# EasyEDA Pro project ProPrj_智能警报器_2025-03-04_22-10-02_2025-04-14.epro, schematic Warning

## Sheets
1 主控: Board Name: 警报装置（旧）; Create Date: 2025-04-03; Page Name: 主控; Project Name: 智能警报器_2025-03-04_22-10-02; Schematic Name: Warning; Update Date: 2025-04-04; Company: 嘉立创EDA; Page Size: A4; Version: V1.0
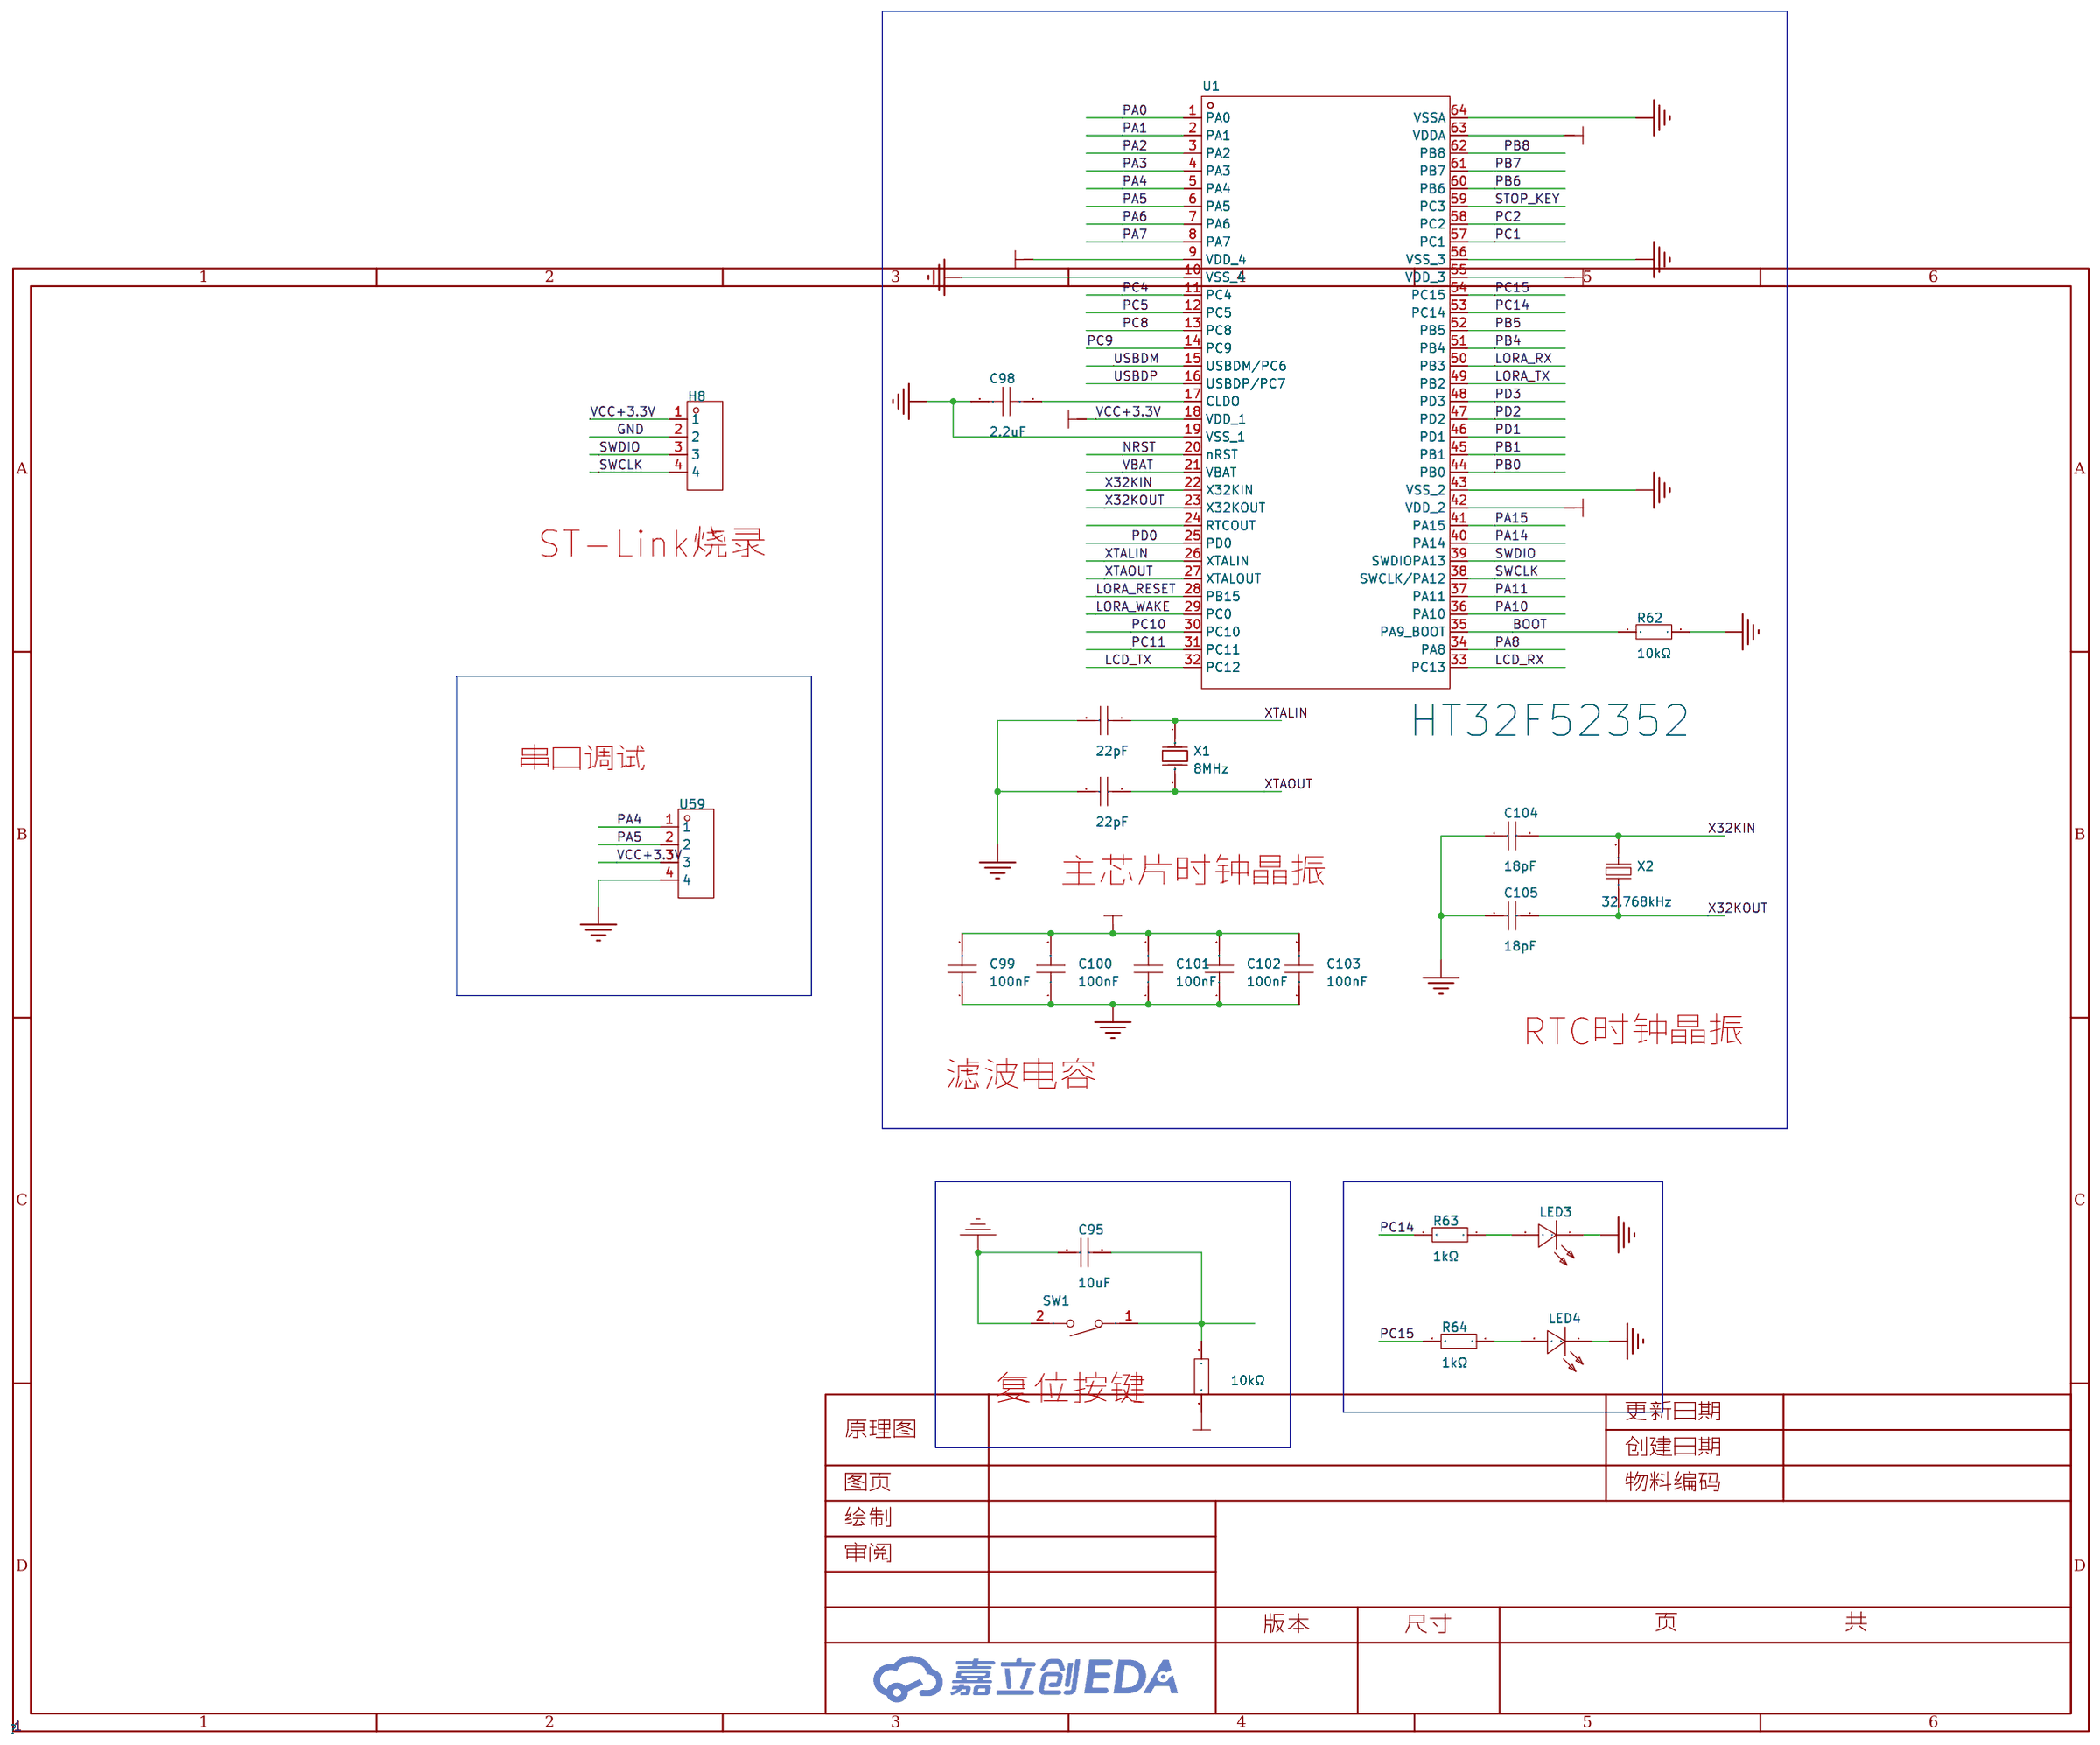
[diagram p0: 主控]
2 模块与接口: Board Name: 警报装置; Page Name: 模块与接口; Update Date: 2025-04-03
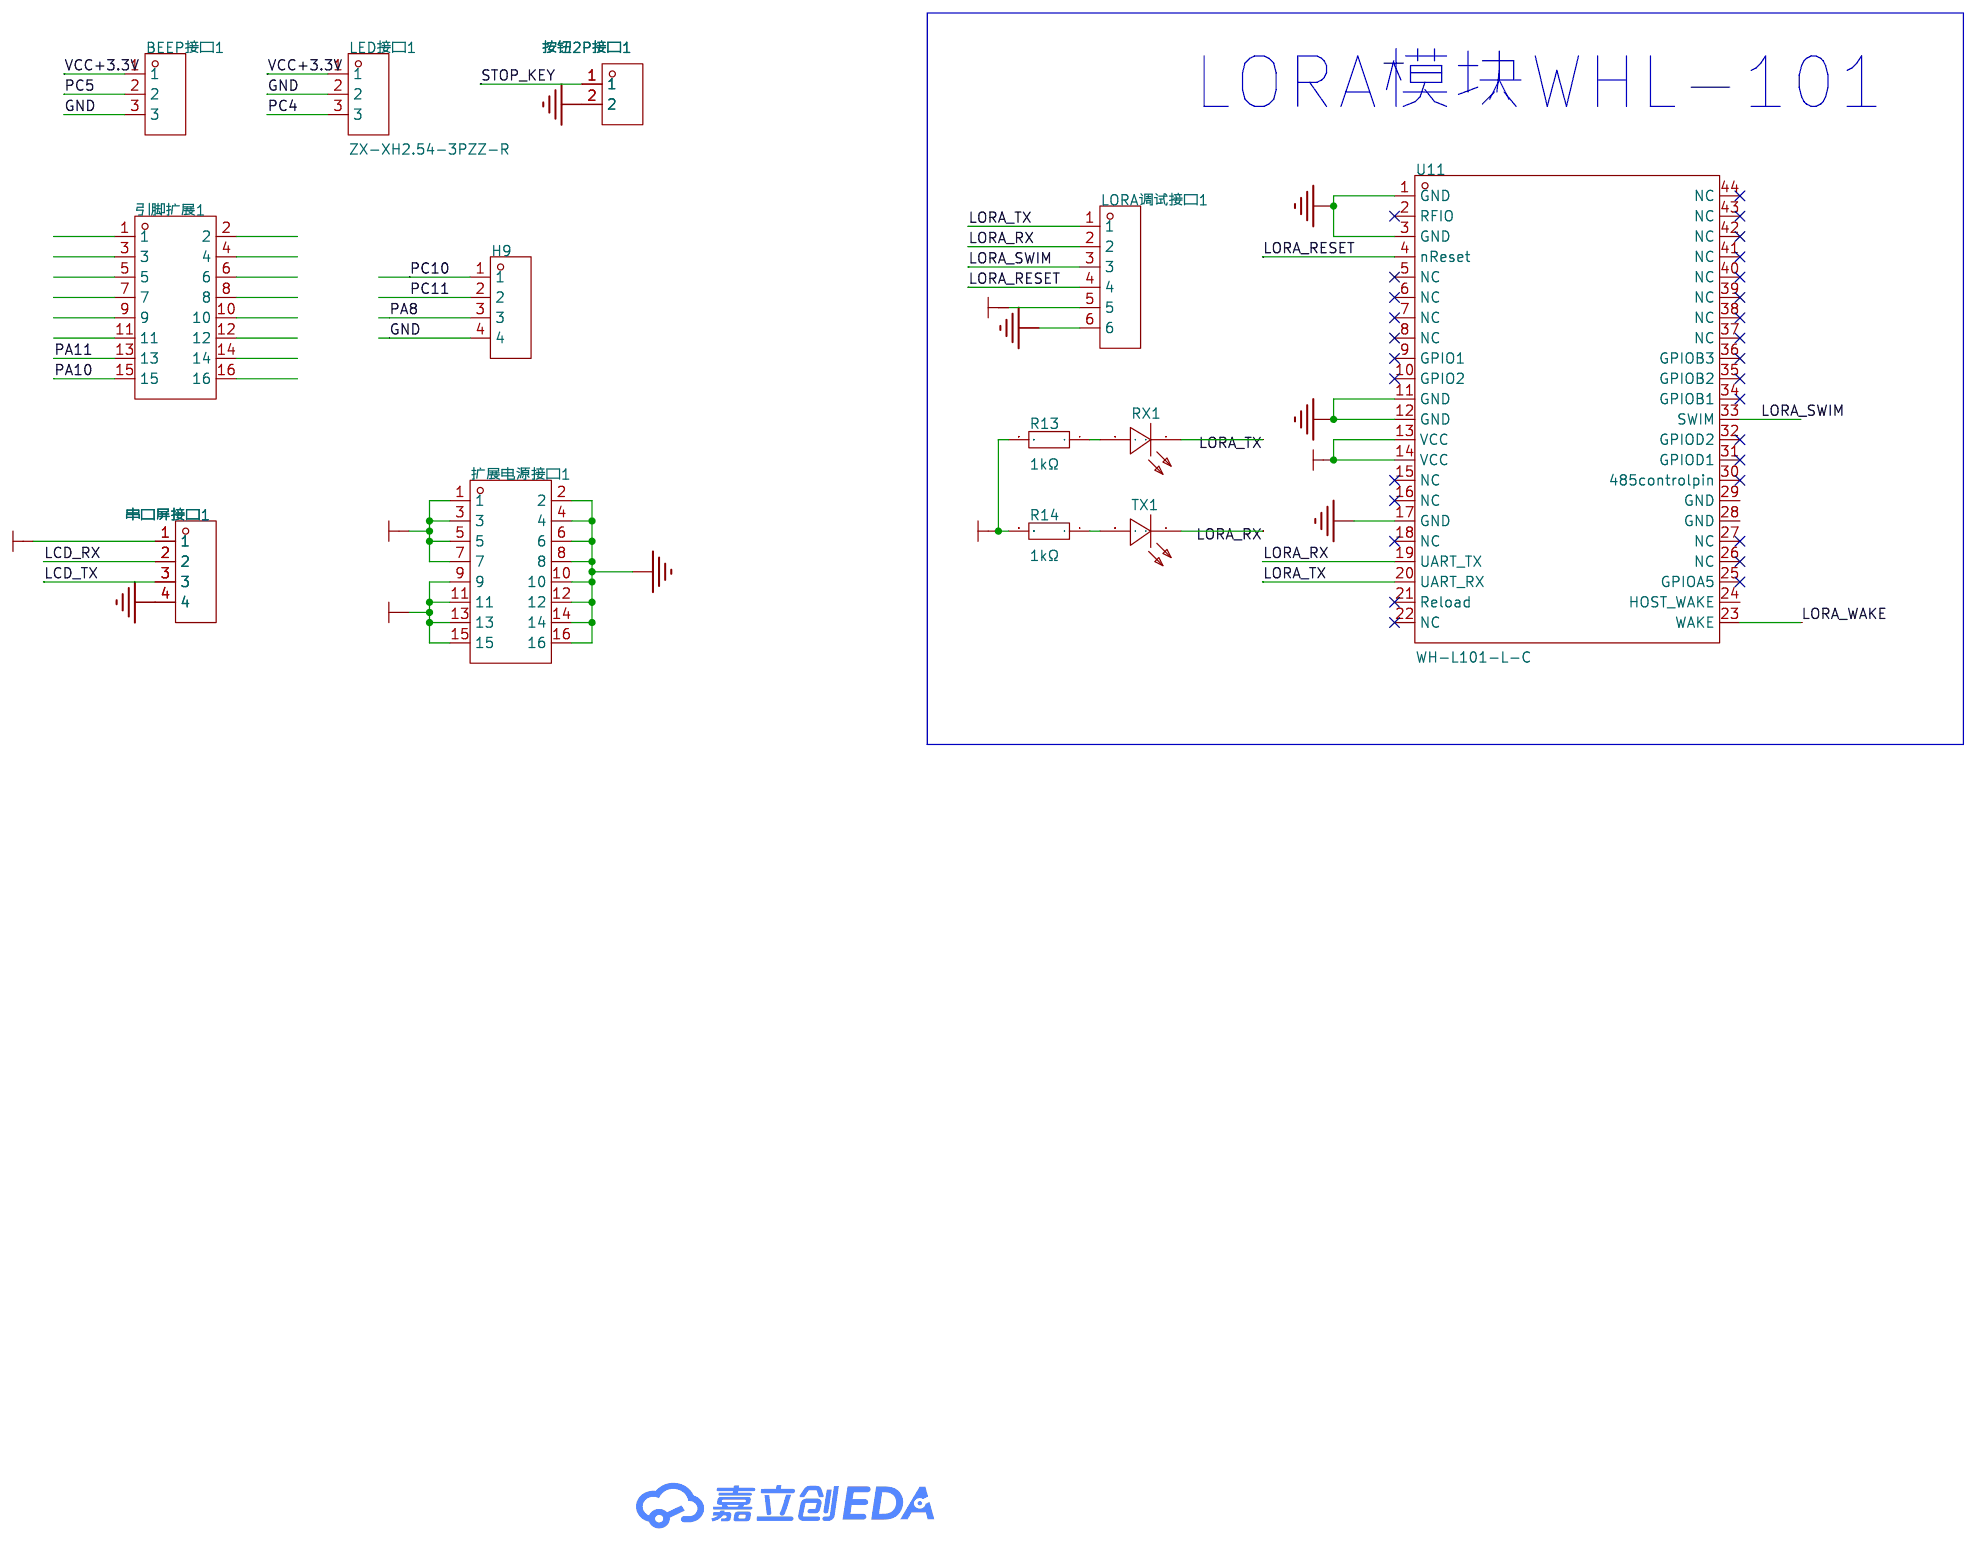
[diagram p1: 模块与接口]
3 电源: Board Name: HT32; Page Name: 电源; Schematic Name: Schematic1_1; Update Date: 2025-04-03
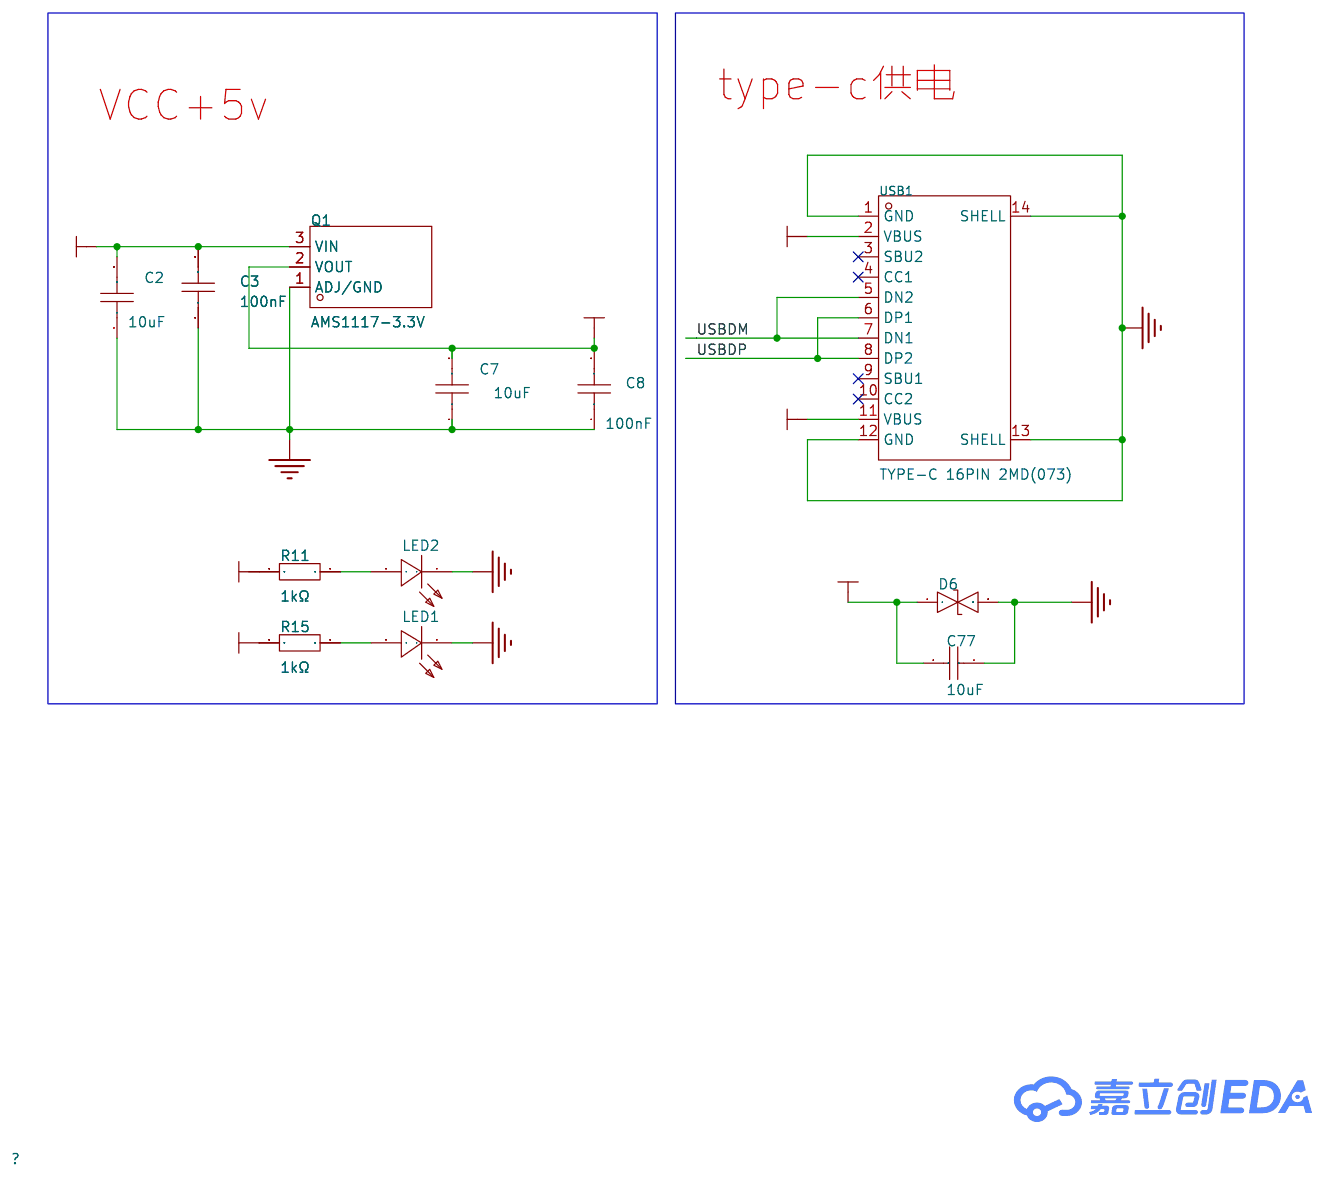
[diagram p2: 电源]

## Parts
sheet 主控
C80  22pF  [C0603]
C81  22pF  [C0603]
C95  10uF  [C0805]
C98  2.2uF  [C0805]
C99  100nF  [C0603]
C100  100nF  [C0603]
C101  100nF  [C0603]
C102  100nF  [C0603]
C103  100nF  [C0603]
C104  18pF  [C0603]
C105  18pF  [C0603]
H8  PZ254V-11-04P  [HDR-TH_4P-P2.54-V-M]
LED3  KT-0603R  [LED0603-RD]
LED4  KT-0603R  [LED0603-RD]
R61  10kΩ  [R0603]
R62  10kΩ  [R0603]
R63  1kΩ  [R0603]
R64  1kΩ  [R0603]
SW1  TS-1088-AR02016  [SW-SMD_L3.9-W3.0-P4.45]
U1  HT32F52352  [LQFP-64_L7.0-W7.0-P0.40-LS9.2-BL]
U59  PM254-1-04-Z-8.5  [HDR-TH_4P-P2.54-V-F]
X1  8MHz  [CRYSTAL-SMD_L5.0-W3.2]
X2  32.768kHz  [FC-135R_L3.2-W1.5]
sheet 模块与接口
BEEP接口1  ZX-XH2.54-3PZZ-R  [CONN-TH_3P-P2.50_ZX-XH2.54-3PZZ-R]
H9  PZ254V-11-04P  [HDR-TH_4P-P2.54-V-M]
LED接口1  ZX-XH2.54-3PZZ-R  [CONN-TH_3P-P2.50_ZX-XH2.54-3PZZ-R]
LORA调试接口1  PZ254-1-06-Z-2.5-G1  [HDR-TH_6P-P2.54-V-M]
R13  1kΩ  [R0603]
R14  1kΩ  [R0603]
RX1  KT-0603R  [LED0603-RD]
TX1  KT-0603R  [LED0603-RD]
U11  WH-L101-L-C  [COMM-SMD_WH-L101-L-C]
串口屏接口1  ZX-XH2.54-4PZZ  [CONN-TH_4P-P2.50_4PIN]
引脚扩展1  PZ254V-12-16P  [HDR-TH_16P-P2.54-V-M-R2-C8-S2.54]
扩展电源接口1  PZ254V-12-16P  [HDR-TH_16P-P2.54-V-M-R2-C8-S2.54]
按钮2P接口1  ZX-XH2.54-2PZZ  [CONN-TH_2P-P2.50_HX25003-2A]
sheet 电源
C2  10uF  [C0603]
C3  100nF  [C0603]
C7  10uF  [C0603]
C8  100nF  [C0603]
C77  10uF  [C0805]
D6  SMBJ6.8CA  [SMB_L4.6-W3.6-LS5.3-BI]
LED1  KT-0603R  [LED0603-RD]
LED2  KT-0603R  [LED0603-RD]
Q1  AMS1117-3.3V  [SOT-89-3_L4.5-W2.5-P1.50-LS4.2-BR]
R11  1kΩ  [R0603]
R15  1kΩ  [R0603]
USB1  TYPE-C 16PIN 2MD(073)  [USB-C-SMD_TYPE-C-6PIN-2MD-073]

## Library data of the parts
C80 C81 = CC0603JRNPO9BN220: 容值:22pF;精度:±5%;额定电压:50V;材质(温度系数):NP0;; LCSC Part Name: 22pF ±5% 50V; Supplier Part: C105620; Manufacturer: YAGEO(国巨); Supplier Footprint: 0603; JLCPCB Part Class: 扩展库; Datasheet: https://atta.szlcsc.com/upload/public/pdf/source/20170505/1493957838062.pdf; Supplier: LCSC; Tolerance: ±5%; Voltage Rated: 50V; Temperature Coefficient: NP0
C77 C95 = CL21A106KAYNNNE_C15850: VCC+5v; LCSC Part Name: VCC+5v; Supplier Part: C15850; Manufacturer: SAMSUNG(三星); Manufacturer Part: CL21A106KAYNNNE; Supplier Footprint: 0805; JLCPCB Part Class: 基础库; Datasheet: https://atta.szlcsc.com/upload/public/pdf/source/20160103/1457707679302.pdf; Supplier: LCSC; Tolerance: ±10%; Voltage Rated: VCC+5v; Temperature Coefficient: X5R
C98 = CL21A225KBQNNNE: 容值:2.2uF;精度:±10%;额定电压:50V;材质(温度系数):X5R;; LCSC Part Name: 2.2uF ±10% 50V; Supplier Part: C377773; Manufacturer: SAMSUNG(三星); Supplier Footprint: 0805; JLCPCB Part Class: 基础库; Datasheet: https://atta.szlcsc.com/upload/public/pdf/source/20160218/1457707763339.pdf; Supplier: LCSC; Tolerance: ±10%; Voltage Rated: 50V; Temperature Coefficient: X5R
C99-C103 = CC0603KRX7R9BB104: 容值:100nF;精度:±10%;额定电压:50V;材质(温度系数):X7R;; LCSC Part Name: 100nF ±10% 50V; Supplier Part: C14663; Manufacturer: YAGEO(国巨); Supplier Footprint: 0603; JLCPCB Part Class: 基础库; Datasheet: https://atta.szlcsc.com/upload/public/pdf/source/20180910/C282072_33301C7F631E79921B82A8DAC6BCC5B3.pdf; Supplier: LCSC; Tolerance: ±10%; Voltage Rated: 50V; Temperature Coefficient: X7R
C104 C105 = CL10C180JB8NNNC: 容值:18pF;精度:±5%;额定电压:50V;材质(温度系数):C0G;; LCSC Part Name: 18pF ±5% 50V; Supplier Part: C1647; Manufacturer: SAMSUNG(三星); Supplier Footprint: 0603; JLCPCB Part Class: 基础库; Datasheet: https://atta.szlcsc.com/upload/public/pdf/source/20160218/1457707763339.pdf; Supplier: LCSC; Tolerance: ±5%; Voltage Rated: 50V; Temperature Coefficient: C0G
H8 H9 = PZ254V-11-04P: 插针结构:1x4P;间距:2.54mm;行距:-;圆针/方针:方针;安装类型:直插;排数:单排;总PIN位数:4P;额定电流:3A;额定电压:250V;配合针长度:6mm;塑高:2.5mm;端接针长度:3mm;触头材质:-;工作温度范围:-40℃~+105℃;颜色:黑色;; LCSC Part Name: 间距:2.54mm 1x4P 直插 方针; Supplier Part: C2691448; Manufacturer: XFCN(兴飞); Supplier Footprint: 插件,P=2.54mm; JLCPCB Part Class: 扩展库; Datasheet: https://atta.szlcsc.com/upload/public/pdf/source/20200309/C492403_F9F19131791D08044AD4F84F8E751A34.pdf; Supplier: LCSC; Pin Structure: 1x4P; Pitch: 2.54mm; Circluar Pins/Square Pins: 方针; Mounting Type: 直插; Number of Rows: 单排; Number of Pins: 4P; Current Rating (Max): 3A; Voltage Rating (Max): 250V; Length of Mating Pin: 6mm; Insulation Height: 2.5mm; Length of End Connection Pin: 3mm; Operating Temperature Range: -40℃~+105℃; Color: 黑色
LED1-LED4 RX1 TX1 = KT-0603R: 发光颜色:红色;功率:-;正向电流:-;主波长:-;二极管配置:-;透镜颜色:-;色温:-;发光角度:-;载带方式:-;工作温度:-40℃~+85℃;; LCSC Part Name: 0603 红灯 高亮; Supplier Part: C2286; Manufacturer: KENTO; Supplier Footprint: 0603; JLCPCB Part Class: 基础库; Datasheet: https://atta.szlcsc.com/upload/public/pdf/source/20160616/1466072038404.pdf; Supplier: LCSC; Emitted Color: 红色; Operating Temperature: -40℃~+85℃
R61 R62 = 0603WAF1002T5E: 电阻类型:厚膜电阻;阻值:10kΩ;精度:±1%;功率:100mW;; LCSC Part Name: 厚膜电阻 10kΩ ±1% 100mW; Supplier Part: C25804; Manufacturer: UNI-ROYAL(厚声); Supplier Footprint: 0603; JLCPCB Part Class: 基础库; Datasheet: https://atta.szlcsc.com/upload/public/pdf/source/20200306/C422600_1E6D84923E4A46A82E41ADD87F860B5C.pdf; Supplier: LCSC; Type: 厚膜电阻; Tolerance: ±1%; Power(Watts): 100mW; Temperature Coefficient: ±100ppm/℃; Overload Voltage (Max): VCC+5v; Operating Temperature Range: -55℃~+155℃
R11 R13-R15 R63 R64 = RC0603FR-071KL: VCC+5v; LCSC Part Name: 厚膜电阻 1kΩ ±1% 100mW; Supplier Part: C22548; Manufacturer: YAGEO(国巨); Supplier Footprint: 0603; JLCPCB Part Class: Extended Part; Datasheet: https://atta.szlcsc.com/upload/public/pdf/source/20180316/70C0E2BDAE7FCC62C531A5A58D202EE1.pdf; Supplier: LCSC; Type: 厚膜电阻; Tolerance: ±1%; Power(Watts): 100mW; Temperature Coefficient: ±100ppm/℃; Overload Voltage (Max): VCC+5v; Operating Temperature Range: -55℃~+155℃
SW1 = TS-1088-AR02016: 触点电流:50mA;额定电压(DC):12V;绝缘电阻:100MΩ;电路结构:单刀单掷;安装方式:立贴;作用力:160gf@±50gf;机械寿命:10万次;带支架:否;; LCSC Part Name: 4*3*2mm 立贴 轻触开关; Supplier Part: C720477; Manufacturer: XUNPU(讯普); Supplier Footprint: SMD; JLCPCB Part Class: 扩展库; Datasheet: https://atta.szlcsc.com/upload/public/pdf/source/20200810/C720475_60D09DD6C54279ADDB2DC25100F1CC11.pdf; Supplier: LCSC; Contact Current: 50mA; Voltage Rating (DC): 12V; Insulation Resistance: 100MΩ; Circuit: 单刀单掷; Mounting Style: 立贴; Actuator Style: 圆形按钮; Actuator/Cap Color: 黑色; Operating Force: 160gf@±50gf; Mechanical Life: 10万次; Operating Temperature: -30℃~+80℃; Pin Style: SMD接片; Switch Length: 4mm; Switch Width: 3mm; Switch Height: 2mm; Strike Gundam: 否
U1 = HT32F52352: CPU内核:CM0;程序存储容量:128KB;RAM总容量:16KB;GPIO端口数量:51;工作电压范围:2V~3.6V;CPU最大主频:48MHz;程序存储器类型:FLASH;; Supplier Part: C97188; Manufacturer: HOLTEK(合泰/盛群); Supplier Footprint: LQFP-64(7x7); JLCPCB Part Class: 扩展库; Datasheet: https://atta.szlcsc.com/upload/public/pdf/source/20231226/5DA994CBD2B5E793EB1549DB6E6CD66A.pdf; Supplier: LCSC; CPU Core: CM0; Program Storage Size: 128KB; RAM Size: 16KB; GPIO Ports Number: 51; Operating Voltage Range: 2V~3.6V; CPU Maximum Speed: 48MHz; Program Memory Type: FLASH; Operating Temperature Range: -40℃~+85℃; ADC (Bit): 12bit; 16Bit Timer: 5; 32Bit Timer: 2; UART/USART: 4; I2C: 2; I2S: 1; SPI: 2; Universal Serial Bus: 有; Internal Comparator: 有; Peripheral/Function: 低电压检测；看门狗；CCP捕获/比较；乘法器；IrDA；CRC校验；DMA；RTC实时时钟; Watchdog: 有; Real-Time Clock: 有; Infrared Data Association: 有; Low-Voltage Detect: 有; CCP Capture/Compare: 有; Direct Memory Access: 有; Internal Oscillator: 有
U59 = PM254-1-04-Z-8.5_C2897367: 插孔结构:1x4P;间距:2.54mm;行距:-;圆孔/方孔:方孔;安装类型:直插;排数:单排;总孔位数:4P;额定电流:3A;额定电压:-;插孔方向:顶部;塑高:8.5mm;触头材质:铜合金;工作温度范围:-40℃~+105℃;焊接温度(最大值):260℃@5S;; LCSC Part Name: 1x4P 间距:2.54mm 直插; Supplier Part: C2897367; Manufacturer: HCTL(华灿天禄); Supplier Footprint: 插件,P=2.54mm; JLCPCB Part Class: 扩展库; Datasheet: https://atta.szlcsc.com/upload/public/pdf/source/20230609/534BE42964C679BDE98E061007C4ABD6.pdf; Supplier: LCSC; Holes Structure: 1x4P; Pitch: 2.54mm; Circular Hole / Square Hole: 方孔; Mounting Type: 直插; Number of Rows: 单排; Number of Holes: 4P; Current Rating (Max): 3A; Holes Direction: 顶部; Insulation Height: 8.5mm; Contact Material: 铜合金; Operating Temperature Range: -40℃~+105℃; Soldering Temperature(Max): 260℃@5S
X1 = X50328MSB2GI: 晶振类型:贴片晶振;频率:8MHz;常温频差:±10ppm;外接负载电容:20pF;频率稳定度(全温):±50ppm;; LCSC Part Name: 8MHz ±10ppm 20pF YSX530GA; Supplier Part: C115962; Manufacturer: YXC(扬兴晶振); Supplier Footprint: SMD5032; JLCPCB Part Class: 基础库; Datasheet: https://atta.szlcsc.com/upload/public/pdf/source/20230220/0EBFFB9D6D8CE6A211407822BBB6C516.pdf; Supplier: LCSC; Crystal Type: 贴片晶振; Normal temperature Frequency Tolerance: ±10ppm; External load capacitor: 20pF; Frequency Stability(Full temperature range): ±50ppm; Operating Temperature: -40℃~+85℃
X2 = Q13FC1350000400: 频率:32.768kHz;频率公差:±20ppm;负载电容:12.5pF;; LCSC Part Name: 32.768kHz ±20ppm 12.5pF; Supplier Part: C32346; Manufacturer: EPSON(爱普生); Supplier Footprint: SMD3215-2P; JLCPCB Part Class: 基础库; Datasheet: https://atta.szlcsc.com/upload/public/pdf/source/20190108/C32346_746D6B07EAF90824457A96480007685F.pdf; Supplier: LCSC; Crystal Type: 贴片无源晶振; Frequency Tolerance: ±20ppm; Load Capacitance: 12.5pF; Equivalent Series Resistance (ESR): 70kΩ; Operating Temperature: -40℃~+85℃
BEEP接口1 LED接口1 = ZX-XH2.54-3PZZ-R: 插针结构:1x3P;间距:2.5mm;安装方式:直插;参考系列:XH;总PIN数:3P;排数:1;每排PIN数:3;行距:-;额定电流:3A;触头材质:铜合金;触头镀层:锡;工作温度范围:-25℃~+85℃;; LCSC Part Name: 1x3P 间距:2.5mm 直插 系列:XH; Supplier Part: C22388625; Manufacturer: Megastar(兆星); Supplier Footprint: 插件,P=2.5mm; JLCPCB Part Class: 扩展库; Datasheet: https://atta.szlcsc.com/upload/public/pdf/source/20240429/AA686AF86527F4AA0E405D3AA558B9D4.pdf; Supplier: LCSC; Pins Structure: 1x3P; Pitch: 2.5mm; Mounting Type: 直插; Reference Series: XH; Number of Pins: 3P; Number of Rows: 1; Number of PINs Per Row: 3; Rated Current: 3A; Contact Material: 铜合金; Contact Plating: 锡; Operating Temperature: -25℃~+85℃; Rated Voltage (Max): 250V; Plastic Material: PA66; Flame Retardant Rating: UL94V-0; Color: 红色; Z-Height of the Board: 7mm; X-Length of Bottom Edge on Board (Spacing Line): 10mm; Y-Width of Bottom Edge on Board: 5.75mm
LORA调试接口1 = PZ254-1-06-Z-2.5-G1: 插针结构:1x6P;间距:2.54mm;行距:-;圆针/方针:方针;安装类型:直插;排数:单排;总PIN位数:6P;额定电流:3A;配合针长度:6mm;塑高:2.5mm;端接针长度:3mm;触头材质:黄铜;工作温度范围:-40℃~+105℃;焊接温度(最大值):260℃@10S;颜色:黑色;; LCSC Part Name: 1x6P 间距:2.54mm 方针 直插; Supplier Part: C18197913; Manufacturer: HCTL(华灿天禄); Supplier Footprint: 插件,P=2.54mm; Datasheet: https://atta.szlcsc.com/upload/public/pdf/source/20230921/1753130D8F97492C8335A75164C0C73A.pdf; Supplier: LCSC; Pin Structure: 1x6P; Pitch: 2.54mm; Circluar Pins/Square Pins: 方针; Mounting Type: 直插; Number of Rows: 单排; Number of Pins: 6P; Current Rating (Max): 3A; Length of Mating Pin: 6mm; Insulation Height: 2.5mm; Length of End Connection Pin: 3mm; Contact Material: 黄铜; Operating Temperature Range: -40℃~+105℃; Soldering Temperature(Max): 260℃@10S; Color: 黑色
U11 = WH-L101-L-C: Supplier Part: C2839188; Manufacturer: USR(有人物联网); Supplier Footprint: SMD,18.2x26.7mm; JLCPCB Part Class: 扩展库; Datasheet: https://atta.szlcsc.com/upload/public/pdf/source/20210707/C2839188_8B9CF052393124210560C9EDFDE3EF54.pdf; Supplier: LCSC
串口屏接口1 = ZX-XH2.54-4PZZ: 插针结构:1x4P;间距:2.54mm;安装方式:直插;参考系列:XH;总PIN数:4P;排数:1;每排PIN数:4;行距:-;额定电流:3A;触头材质:黄铜;触头镀层:锡;工作温度范围:-25℃~+85℃;; Supplier Part: C7429634; Manufacturer: Megastar(兆星); Supplier Footprint: 插件,P=2.54mm; Datasheet: https://atta.szlcsc.com/upload/public/pdf/source/20230619/B529A2163E0159A644AB3383D208FB03.pdf; Supplier: LCSC; Pins Structure: 1x4P; Pitch: 2.54mm; Mounting Style: 直插; Reference Series: XH; Number of Pins: 4P; Number of Rows: 1; Number of PINs Per Row: 4; Current Rating (Max): 3A; Contact Material: 黄铜; Contact Plating: 锡; Operating Temperature Range: -25℃~+85℃
引脚扩展1 扩展电源接口1 = PZ254V-12-16P: 插针结构:2x8P;间距:2.54mm;行距:2.54mm;圆针/方针:方针;安装类型:直插;排数:双排;总PIN位数:16P;额定电流:-;额定电压:-;配合针长度:6mm;塑高:2.5mm;端接针长度:3mm;触头材质:黄铜;触头镀层:-;工作温度范围:-40℃~+105℃;颜色:黑色;; LCSC Part Name: 间距:2.54mm 2x8P 直插 方针; Supplier Part: C492425; Manufacturer: XFCN(兴飞); Supplier Footprint: 插件,P=2.54mm; JLCPCB Part Class: 扩展库; Datasheet: https://atta.szlcsc.com/upload/public/pdf/source/20200309/C492425_0A00EE06259AD0A0AB9C88167BB69964.pdf; Supplier: LCSC; Pin Structure: 2x8P; Pitch: 2.54mm; Row Spacing: 2.54mm; Circluar Pins/Square Pins: 方针; Mounting Type: 直插; Number of Rows: 双排; Number of Pins: 16P; Length of Mating Pin: 6mm; Insulation Height: 2.5mm; Length of End Connection Pin: 3mm; Contact Material: 黄铜; Operating Temperature Range: -40℃~+105℃; Color: 黑色
按钮2P接口1 = ZX-XH2.54-2PZZ: 插针结构:1x2P;间距:2.54mm;安装方式:直插;参考系列:XH;总PIN数:2P;排数:1;每排PIN数:2;行距:-;额定电流:3A;触头材质:黄铜;触头镀层:锡;工作温度范围:-25℃~+85℃;; Supplier Part: C7429632; Manufacturer: Megastar(兆星); Supplier Footprint: 插件,P=2.54mm; Datasheet: https://atta.szlcsc.com/upload/public/pdf/source/20230619/19BA6947230AA44A04D3EDD65E618FD0.pdf; Supplier: LCSC; Pins Structure: 1x2P; Pitch: 2.54mm; Mounting Style: 直插; Reference Series: XH; Number of Pins: 2P; Number of Rows: 1; Number of PINs Per Row: 2; Current Rating (Max): 3A; Contact Material: 黄铜; Contact Plating: 锡; Operating Temperature Range: -25℃~+85℃
C2 C7 = GRM188R61E106KA73D: VCC+5v; LCSC Part Name: VCC+5v; Supplier Part: C344022; Manufacturer: muRata(村田); Supplier Footprint: 0603; JLCPCB Part Class: Extended Part; Datasheet: https://atta.szlcsc.com/upload/public/pdf/source/20181211/C344022_BB98D43E7DA95E5A749FBFE073C8A3E0.pdf; Supplier: LCSC; Tolerance: ±10%; Voltage Rated: VCC+5v; Temperature Coefficient: X5R
C3 C8 = CC0603KRX7R9BB104: 容值:100nF;精度:±10%;额定电压:50V;材质(温度系数):X7R;; LCSC Part Name: 100nF ±10% 50V; Supplier Part: C14663; Manufacturer: YAGEO(国巨); Supplier Footprint: 0603; JLCPCB Part Class: Basic Part; Datasheet: https://atta.szlcsc.com/upload/public/pdf/source/20180910/C282072_33301C7F631E79921B82A8DAC6BCC5B3.pdf; Supplier: LCSC; Tolerance: ±10%; Voltage Rated: 50V; Temperature Coefficient: X7R
D6 = SMBJ6.8CA_C383713: VCC+5v; Supplier Part: C383713; Manufacturer: BORN(伯恩半导体); Supplier Footprint: SMB(DO-214AA); JLCPCB Part Class: 扩展库; Datasheet: https://atta.szlcsc.com/upload/public/pdf/source/20190828/C383713_0FA059764A36A2B4EE02FD311BBD1A5C.pdf; Supplier: LCSC; Reverse Stand-Off Voltage (Vrwm): 5.8V; Maximum Clamping Voltage: VCC+5v; Peak Pulse Current (Ipp)@10/1000us: 58.1A; Breakdown Voltage: VCC+5v; Reverse Leakage Current (Ir): 500uA
Q1 = AMS1117-3.3V_C5120796: 输出类型:固定;输出极性:正;最大输入电压:18V;输出电压:3.3V;输出电流:1A;; Supplier Part: C5120796; Manufacturer: MSKSEMI(美森科); Supplier Footprint: SOT-89; JLCPCB Part Class: 扩展库; Datasheet: https://atta.szlcsc.com/upload/public/pdf/source/20220727/5E62EAC46FFFF83337622C0FBE1B6BF8.pdf; Supplier: LCSC; Output Type: 固定; Output Polarity: 正; Number of Outputs: 1; Maximum Input Voltage: 18V; Output Voltage: 3.3V; Dropout Voltage: 1.4V@(1A); Quiescent Current (Ground Current): 12mA; Output Current: 1A; Operating Temperature: 0℃~+125℃
USB1 = TYPE-C 16PIN 2MD(073): 连接器类型:Type-C;标准:-;公母:母;端口数量:1;触点数量:16P;安装方式:卧贴;额定电流 - 电源:5A;工作温度范围:-25℃~+85℃;; LCSC Part Name: Type-C 母 卧贴; Supplier Part: C2765186; Manufacturer: SHOU HAN(首韩); Supplier Footprint: SMD; Datasheet: https://atta.szlcsc.com/upload/public/pdf/source/20211123/39B17C16241EAC15C5E277BDA434118E.pdf; Supplier: LCSC; Connector Type: Type-C; Gender: 母; Number of Ports: 1; Number of Contacts: 16P; Mounting Style: 卧贴; Current Rating - Power (Max): 5A; Operating Temperature Range: -25℃~+85℃

## Nets
GND: BEEP接口1.3 C2.1 C3.1 C7.1 C8.1 C77.1 C80.2 C81.2 C95.1 C98.2 C99.1 C100.1 C101.1 C102.1 C103.1 C104.1 C105.1 D6.2 H8.2 H9.4 LED1.1(K) LED2.1(K) LED3.1(K) LED4.1(K) LED接口1.2 LORA调试接口1.6 Q1.1(ADJ/GND) R62.1 SW1.2 U1.10(VSS_4) U1.19(VSS_1) U1.43(VSS_2) U1.56(VSS_3) U1.64(VSSA) U11.1(GND) U11.3(GND) U11.11(GND) U11.12(GND) U11.17(GND) U59.4 USB1.1(GND) USB1.12(GND) USB1.13(SHELL) USB1.14(SHELL) 串口屏接口1.4 扩展电源接口1.2 扩展电源接口1.4 扩展电源接口1.6 扩展电源接口1.8 扩展电源接口1.10 扩展电源接口1.12 扩展电源接口1.14 扩展电源接口1.16 按钮2P接口1.2
VBAT: U1.21(VBAT)
VCC+3.3V: BEEP接口1.1 C7.2 C8.2 C99.2 C100.2 C101.2 C102.2 C103.2 H8.1 LED接口1.1 LORA调试接口1.5 Q1.2(VOUT) R13.2 R14.2 R15.2 R61.2 U1.9(VDD_4) U1.18(VDD_1) U1.42(VDD_2) U1.55(VDD_3) U1.63(VDDA) U11.13(VCC) U11.14(VCC) U59.3 扩展电源接口1.1 扩展电源接口1.3 扩展电源接口1.5 扩展电源接口1.7
VCC+5V: C2.2 C3.2 C77.2 D6.1 Q1.3(VIN) R11.2 USB1.2(VBUS) USB1.11(VBUS) 串口屏接口1.1 扩展电源接口1.9 扩展电源接口1.11 扩展电源接口1.13 扩展电源接口1.15
BOOT: R62.2 U1.35(PA9_BOOT)
LCD_RX: U1.33(PC13) 串口屏接口1.2
LCD_TX: U1.32(PC12) 串口屏接口1.3
LORA_RESET: LORA调试接口1.4 U1.28(PB15) U11.4(nReset)
LORA_RX: LORA调试接口1.2 TX1.1(K) U1.50(PB3) U11.19(UART_TX)
LORA_SWIM: LORA调试接口1.3 U11.33(SWIM)
LORA_TX: LORA调试接口1.1 RX1.1(K) U1.49(PB2) U11.20(UART_RX)
LORA_WAKE: U1.29(PC0) U11.23(WAKE)
NRST: U1.20(nRST)
PA0: U1.1(PA0)
PA1: U1.2(PA1)
PA2: U1.3(PA2)
PA3: U1.4(PA3)
PA4: U1.5(PA4) U59.1
PA5: U1.6(PA5) U59.2
PA6: U1.7(PA6)
PA7: U1.8(PA7)
PA8: H9.3 U1.34(PA8)
PA10: U1.36(PA10) 引脚扩展1.15
PA11: U1.37(PA11) 引脚扩展1.13
PA14: U1.40(PA14)
PA15: U1.41(PA15)
PB0: U1.44(PB0)
PB1: U1.45(PB1)
PB4: U1.51(PB4)
PB5: U1.52(PB5)
PB6: U1.60(PB6)
PB7: U1.61(PB7)
PB8: U1.62(PB8)
PC1: U1.57(PC1)
PC2: U1.58(PC2)
PC4: LED接口1.3 U1.11(PC4)
PC5: BEEP接口1.2 U1.12(PC5)
PC8: U1.13(PC8)
PC9: U1.14(PC9)
PC10: H9.1 U1.30(PC10)
PC11: H9.2 U1.31(PC11)
PC14: R63.2 U1.53(PC14)
PC15: R64.2 U1.54(PC15)
PD0: U1.25(PD0)
PD1: U1.46(PD1)
PD2: U1.47(PD2)
PD3: U1.48(PD3)
STOP_KEY: U1.59(PC3) 按钮2P接口1.1
SWCLK: H8.4 U1.38(SWCLK/PA12)
SWDIO: H8.3 U1.39(SWDIOPA13)
USBDM: U1.15(USBDM/PC6) USB1.5(DN2) USB1.7(DN1)
USBDP: U1.16(USBDP/PC7) USB1.6(DP1) USB1.8(DP2)
X32KIN: C104.2 U1.22(X32KIN) X2.2
X32KOUT: C105.2 U1.23(X32KOUT) X2.1
XTALIN: C81.1 U1.26(XTALIN) X1.1(OSC1)
XTAOUT: C80.1 U1.27(XTALOUT) X1.2(OSC2)
$1N1719: C98.1 U1.17(CLDO)
$1N3071: C95.2 R61.1 SW1.1
$1N5057: LED3.2(A) R63.1
$1N5060: LED4.2(A) R64.1
$2N1998: R14.1 TX1.2(A)
$2N1999: R13.1 RX1.2(A)
$3N700: LED2.2(A) R11.1
$3N701: LED1.2(A) R15.1

Not connected (* = marked no-connect by the designer): U1 24(RTCOUT); U11 2(RFIO)* 5(NC)* 6(NC)* 7(NC)* 8(NC)* 9(GPIO1)* 10(GPIO2)* 15(NC)* 16(NC)* 18(NC)* 21(Reload)* 22(NC)* 24(HOST_WAKE) 25(GPIOA5)* 26(NC)* 27(NC)* 28(GND) 29(GND) 30(485controlpin)* 31(GPIOD1)* 32(GPIOD2)* 34(GPIOB1)* 35(GPIOB2)* 36(GPIOB3)* 37(NC)* 38(NC)* 39(NC)* 40(NC)* 41(NC)* 42(NC)* 43(NC)* 44(NC)*; USB1 3(SBU2)* 4(CC1)* 9(SBU1)* 10(CC2)*; 引脚扩展1 1 2 3 4 5 6 7 8 9 10 11 12 14 16

## Notes on the sheets
sheet 1
- ST-Link烧录
- 串口调试
- 主芯片时钟晶振
- RTC时钟晶振
- 滤波电容
- 复位按键
sheet 2
- LORA模块WHL-101
sheet 3
- type-c供电
- VCC+5v
- VCC+5v
